# EAGLE design Bartosz.Nowakowski (EAGLE 9.6.0)
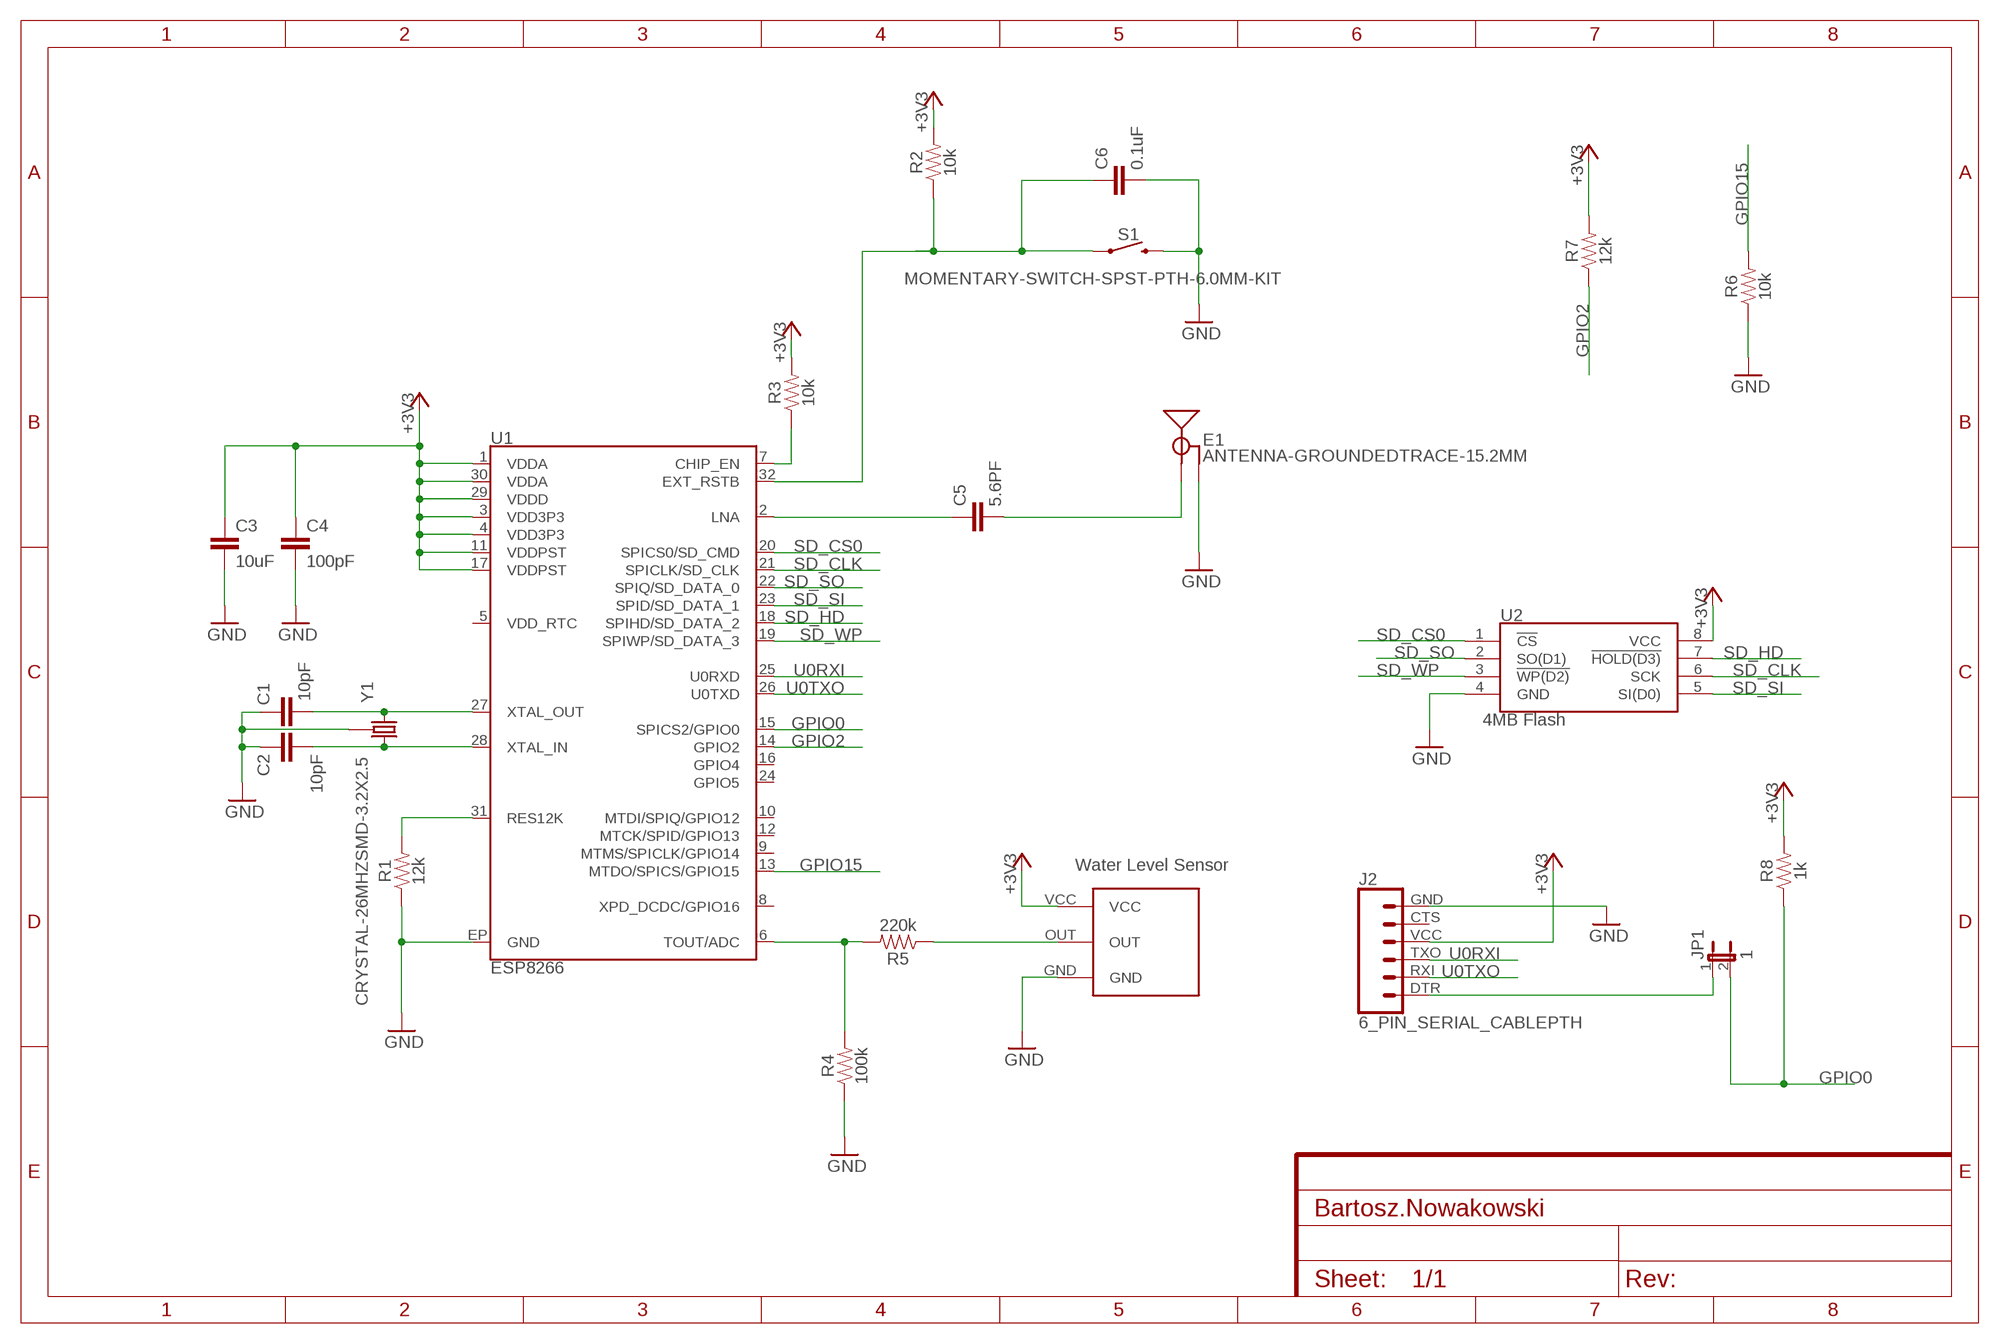
[diagram p0: schematic, sheet 1]

## Parts
C1  10pF  10PF-0603-50V-5%  [0603]
C2  10pF  10PF-0603-50V-5%  [0603]
C3  10uF  10UF-0805-10V-10%  [0805]
C4  100pF  100PF-0603-50V-5%  [0603]
C5  5.6PF  5.6PF-0603-50V-5%  [0603]
C6  0.1uF  0.1UF-0603-25V-5%  [0603]
E1  ANTENNA-GROUNDEDTRACE-15.2MM  [TRACE_ANTENNA_2.4GHZ_15.2MM]
J2  6_PIN_SERIAL_CABLEPTH  [FTDI_BASIC]
JP1  1  JP1E  [JP1]
R1  12k  12KOHM-0603-1/10W-1%  [0603]
R2  10k  10KOHM-0603-1/10W-1%  [0603]
R3  10k  10KOHM-0603-1/10W-1%  [0603]
R4  100k  100KOHM-0603-1/10W-1%  [0603]
R5  220k  220KOHM-0603-1/10W-1%  [0603]
R6  10k  10KOHM-0603-1/10W-1%  [0603]
R7  12k  12KOHM-0603-1/10W-1%  [0603]
R8  1k  1KOHM-0603-1/10W-1%  [0603]
S1  MOMENTARY-SWITCH-SPST-PTH-6.0MM-KIT  [TACTILE_SWITCH_PTH_6.0MM_KIT]
U1  ESP8266  [QFN32-5X5MM]
U2  4MB Flash  AT25SF041  [SO08]
WATER1  WATERLEVELSENORDEV  [WATERLEVELSENSORFT]
Y1  CRYSTAL-26MHZSMD-3.2X2.5  [CRYSTAL-SMD-3.2X2.5MM]

## Nets
+3V3: C3.1 C4.1 J2.VCC R2.2 R3.2 R7.2 R8.2 U1.1(VDDA) U1.3(VDD3P3) U1.4(VDD3P3) U1.11(VDDPST) U1.17(VDDPST) U1.29(VDDD) U1.30(VDDA) U2.8(VCC) WATER1.VCC
GND: C1.1 C2.1 C3.2 C4.2 C6.2 E1.GND J2.GND R1.1 R4.1 R6.1 S1.3 U1.EP(GND) U2.4(GND) WATER1.GND Y1.2 Y1.4
GPIO0: JP1.2 R8.1 U1.15(SPICS2/GPIO0)
GPIO2: R7.1 U1.14(GPIO2)
GPIO15: R6.2 U1.13(MTDO/SPICS/GPIO15)
N$1: R1.2 U1.31(RES12K)
N$2: C1.2 U1.27(XTAL_OUT) Y1.1
N$3: C2.2 U1.28(XTAL_IN) Y1.3
N$4: R3.1 U1.7(CHIP_EN)
N$5: C6.1 R2.1 S1.1 U1.32(EXT_RSTB)
N$6: C5.1 U1.2(LNA)
N$7: C5.2 E1.ANT(SIGNAL)
N$8: R4.2 R5.2 U1.6(TOUT/ADC)
N$9: R5.1 WATER1.OUT
N$10: J2.DTR JP1.1
SD_CLK: U1.21(SPICLK/SD_CLK) U2.6(SCK)
SD_CS0: U1.20(SPICS0/SD_CMD) U2.1(!CS)
SD_HD: U1.18(SPIHD/SD_DATA_2) U2.7(!HOLD(D3))
SD_SI: U1.23(SPID/SD_DATA_1) U2.5(SI(D0))
SD_SO: U1.22(SPIQ/SD_DATA_0) U2.2(SO(D1))
SD_WP: U1.19(SPIWP/SD_DATA_3) U2.3(!WP(D2))
U0RXI: J2.TXO U1.25(U0RXD)
U0TXO: J2.RXI U1.26(U0TXD)
Unconnected: J2.CTS U1.5(VDD_RTC) U1.8(XPD_DCDC/GPIO16) U1.9(MTMS/SPICLK/GPIO14) U1.10(MTDI/SPIQ/GPIO12) U1.12(MTCK/SPID/GPIO13) U1.16(GPIO4) U1.24(GPIO5)

## Library data of the parts
C1 C2 = SparkFun-Capacitors:10PF: 10pF ceramic capacitors A capacitor is a passive two-terminal electrical component used to store electrical energy temporarily in an electric field.; PROD_ID: CAP-11812
C3 = SparkFun-Capacitors:10UF: 10.0µF ceramic capacitors A capacitor is a passive two-terminal electrical component used to store electrical energy temporarily in an electric field.; PROD_ID: CAP-11330
C4 = SparkFun-Capacitors:100PF: 100pF/0.1nF ceramic capacitors A capacitor is a passive two-terminal electrical component used to store electrical energy temporarily in an electric field.; PROD_ID: CAP-07883
C5 = SparkFun-Capacitors:5.6PF: 5.6pF ceramic capacitors A capacitor is a passive two-terminal electrical component used to store electrical energy temporarily in an electric field.; PROD_ID: CAP-12456
C6 = SparkFun-Capacitors:0.1UF: 0.1µF ceramic capacitors A capacitor is a passive two-terminal electrical component used to store electrical energy temporarily in an electric field.; PROD_ID: CAP-08604
E1 = SparkFun-RF:ANTENNA-GROUNDED: Antenna w/ Ground Connection 2.4GHz antennae with signal and ground terminals. TRACE_ANTENNA_2.4GHZ_15.2MM - Meander Trace antenna 15.2 x 5.7mm footprint Based on layout from TI app note AN043 <http://www.ti.com/lit/an/swra117d/swra117d.pdf>. TRACE_ANTENNA_2.4GHZ_25.7MM - Inverted F trace antenna 25.7 x 7.5 mm footprint. Based on layout from TI design note DN0007 <http://www.ti.com/lit/an/swru120b/swru120b.pdf>.
J2 = SparkFun-Connectors:6_PIN_SERIAL_CABLE: 6-pin header connection for use with the "FTDI BASIC" pinout - CABLE SIDE. Also known as "Arduino Serial Program Header". This is used on a design to provide a 6-pin connection point for serial communication usually from a USB cable (D+/D-) to these headers (RX/TX). It also has the remaining pins necessary for programming in the Arduino evironment (DTR, GND, and sometimes VCC). Note, this device has "CABLE" in the name. It is intended to be used on a design that usually lives on the end of your USB cable and prvides the converter chip (FTDI232 or FTDI231x) to commnicate serial RX/TX. The "sister" device, named "TARGET" is inteneded to be used on a design that contains a target micro-controller that you wish to program. You can populate with some of these: Female Headers <https://www.sparkfun.com/products/115> (PRT-00115) For reference (or to suit your programming needs) check out these designs: SparkFun FTDI Basic Breakout - 5V <https://www.sparkfun.com/products/9716> (DEV-09716) SparkFun FTDI Basic Breakout - 3.3V <https://www.sparkfun.com/products/9873> (DEV-09873) SparkFun FTDI SmartBasic <https://www.sparkfun.com/products/12935> (DEV-12935) SparkFun Beefy 3 - FTDI Basic Breakout <https://www.sparkfun.com/products/13746> (DEV-13746)
JP1 = jumper:JP1E: JUMPER
R1 R7 = SparkFun-Resistors:12KOHM: 12kΩ resistor A resistor is a passive two-terminal electrical component that implements electrical resistance as a circuit element. Resistors act to reduce current flow, and, at the same time, act to lower voltage levels within circuits. - Wikipedia; PROD_ID: RES-10327
R2 R3 R6 = SparkFun-Resistors:10KOHM: 10kΩ resistor A resistor is a passive two-terminal electrical component that implements electrical resistance as a circuit element. Resistors act to reduce current flow, and, at the same time, act to lower voltage levels within circuits. - Wikipedia; PROD_ID: RES-00824
R4 = SparkFun-Resistors:100KOHM: 100kΩ resistor A resistor is a passive two-terminal electrical component that implements electrical resistance as a circuit element. Resistors act to reduce current flow, and, at the same time, act to lower voltage levels within circuits. - Wikipedia; PROD_ID: RES-07828
R5 = SparkFun-Resistors:220KOHM: 220kΩ resistor A resistor is a passive two-terminal electrical component that implements electrical resistance as a circuit element. Resistors act to reduce current flow, and, at the same time, act to lower voltage levels within circuits. - Wikipedia; PROD_ID: RES-08969
R8 = SparkFun-Resistors:1KOHM: 1kΩ resistor A resistor is a passive two-terminal electrical component that implements electrical resistance as a circuit element. Resistors act to reduce current flow, and, at the same time, act to lower voltage levels within circuits. - Wikipedia; PROD_ID: RES-07856
S1 = SparkFun-Switches:MOMENTARY-SWITCH-SPST: Momentary Switch (Pushbutton) - SPST Normally-open (NO) SPST momentary switches (buttons, pushbuttons). Variants PTH-12MM - 12mm square, through-hole Momentary Pushbutton Switch - 12mm Square <https://www.sparkfun.com/products/9190> (COM-09190) PTH-6.0MM, PTH-6.0MM-KIT - 6.0mm square, through-hole Mini Pushbutton Switch <https://www.sparkfun.com/products/97> (COM-00097) KIT package intended for soldering kit's - only one side of pads' copper is exposed. PTH-RIGHT-ANGLE-KIT - Right-angle, through-hole Right Angle Tactile Button <https://www.sparkfun.com/products/10791> - Used on SparkFun BigTime Watch Kit <https://www.sparkfun.com/products/11734> SMD-12MM - 12mm square, surface-mount Tactile Button - SMD (12mm) <https://www.sparkfun.com/products/12993> (COM-12993) Used on SparkFun PicoBoard <https://www.sparkfun.com/products/11888> SMD-4.5MM - 4.5mm Square Trackball Switch Used on SparkFun Blackberry Trackballer Breakout <https://www.sparkfun.com/products/13169> SMD-4.6MMX2.8MM - 4.60mm x 2.80mm, surface mount Used on SparkFun SAMD21 Mini Breakout <https://www.sparkfun.com/products/13664> SMD-5.2MM, SMD-5.2-REDUNDANT - 5.2mm square, surface-mount Mini Pushbutton Switch - SMD <https://www.sparkfun.com/products/8720> (COM-08720) Used on Arduino Pro Mini <https://www.sparkfun.com/products/11114> REDUNDANT package connects both switch circuits together SMD-6.0X3.5MM - 6.0 x 3.5mm, surface mount Momentary Reset Switch SMD <https://www.sparkfun.com/products/8229> (COM-08229) SMD-6.2MM-TALL - 6.2mm square, surface mount Tactile Button - SMD (6mm) <https://www.sparkfun.com/products/12992> Used on SparkFun Digital Sandbox <https://www.sparkfun.com/products/12651> SMD-RIGHT-ANGLE - Right-angle, surface mount Used on SparkFun Block for Intel® Edison - Arduino <https://www.sparkfun.com/products/13036>; PROD_ID: SWCH-08441; SF_SKU: COM-00097
U1 = SparkFun-RF:ESP8266: Espressif ESP8266 WiFi/Microcontroller SoC The ESP8266 WiFi Module is a self contained SOC with integrated TCP/IP protocol stack that can give any microcontroller access to your WiFi network. The ESP8266 is capable of either hosting an application or offloading all Wi-Fi networking functions from another application processor. SparkFun Products WiFi Module ESP8266 <https://www.sparkfun.com/products/13678> (WRL-13678) SparkFun ESP8266 Thing <https://www.sparkfun.com/products/13231> (WRL-13231) SparkFun WiFi Shield - ESP8266 <https://www.sparkfun.com/products/13287> (WRL-13287) SparkFun ESP8266 Thing - Dev Board <https://www.sparkfun.com/products/13711> (WRL-13711) SparkFun Blynk Board - ESP8266 <https://www.sparkfun.com/products/13794> (WRL-13794); PROD_ID: IC-12452
U2 = SparkFun-IC-Memory:AT25SF041: AT25SF041 4Mb Serial Flash Memory 104MHz, SPI, 8-SOIC Datasheet <http://www.adestotech.com/wp-content/uploads/DS-AT25SF041_044.pdf> SparkFun Products: SparkFun ESP8266 Thing <https://www.sparkfun.com/products/13231> SparkFun ESP8266 Thing - Dev Board <https://www.sparkfun.com/products/13711>; PROD_ID: IC-12455
WATER1 = WaterLevel:WATERLEVELSENORDEV
Y1 = SparkFun-Clocks:CRYSTAL-26MHZ: 26MHz Crystal w/ Ground Pin Digikey Example <http://www.digikey.com/product-detail/en/epson/TSX-3225%2026.0000MF09Z-AC3/SER3627CT-ND/1802878> Frequency: 26MHz Frequency Stability: ±9ppm Frequency Tolerance: ±10ppm Load Capacitance: 9pF SparkFun Products: SparkFun ESP32 Thing <https://www.sparkfun.com/products/13907> SparkFun ESP8266 Thing Dev Board <https://www.sparkfun.com/products/13711>; PROD_ID: XTAL-12454

## Board
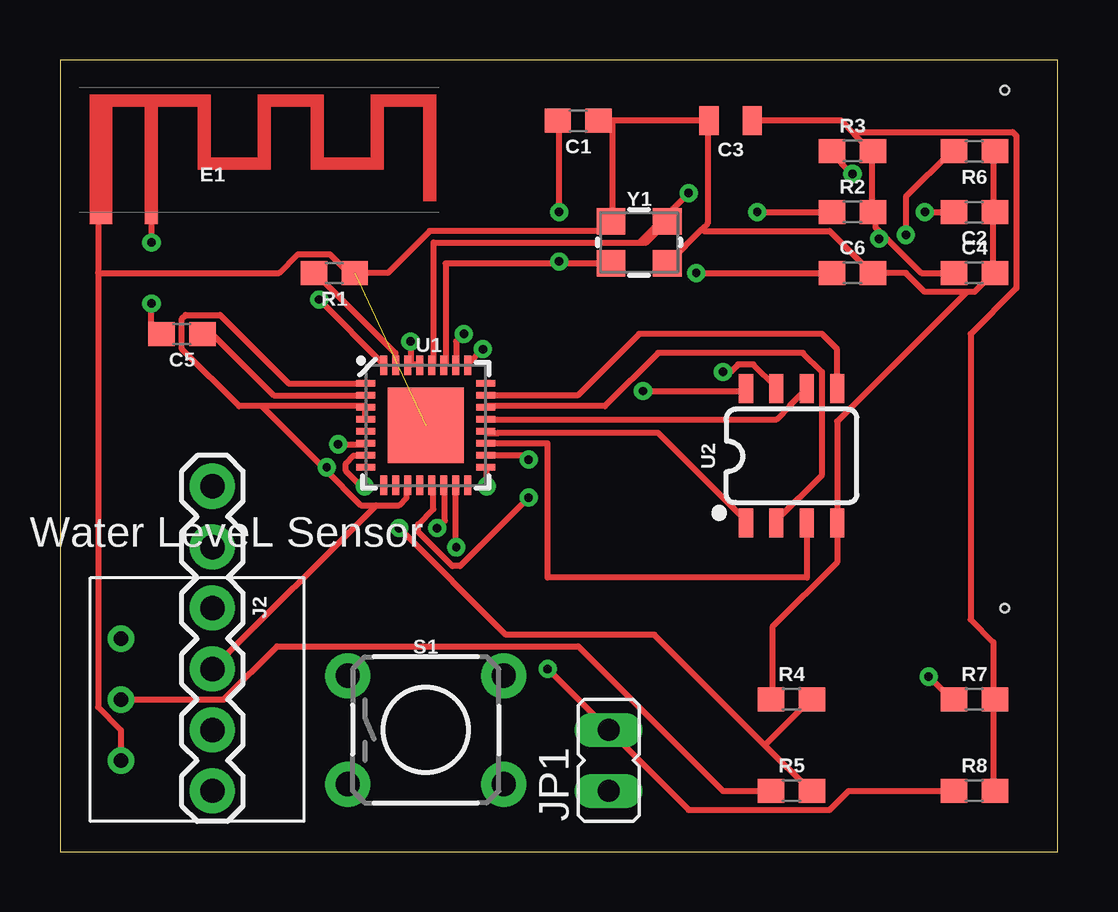
[diagram p1: board, top side]
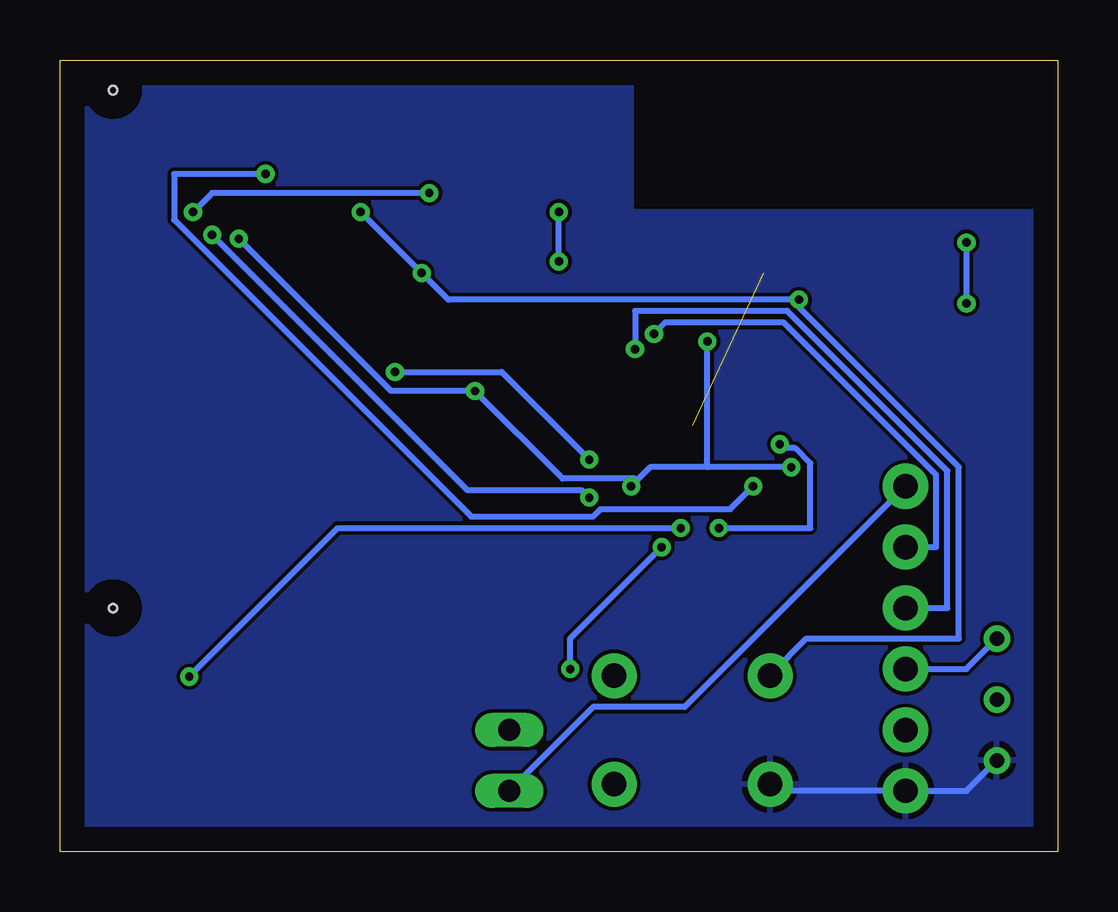
[diagram p2: board, bottom side, seen from below]

Size 41.58 x 33.01 mm. Coordinates in mm from the lower left corner, seen from the top.
Outline: 0,0 41.58,0 41.58,33.01 0,33.01 0,0
Copper layers (1*16): Top 0.035mm / dielectric 1.5mm / Bottom 0.035mm
Design rules "default *": minimum track width 10mil, minimum drill 0.35mm, track to track 6mil, track to pad 6mil, pad to pad 6mil, via to via 6mil, smd to smd 6mil, copper to edge 40mil, drill to drill 6mil, minimum pad ring 10mil, minimum via ring 8mil, stop-mask expansion 4mil, vias tented up to drill 0mil, thermal gap 10mil
Holes 0.35 mm at 39.37,31.75 39.37,10.16

### Footprints (pad centres in the part's own frame; a part is rotated, then mirrored left to right if it is on the bottom)
0603 = smd 1.1 x 1: 1 -0.85,0; 2 0.85,0
0805 = smd 0.8 x 1.2: 1 -0.9,0; 2 0.9,0
TRACE_ANTENNA_2.4GHZ_15.2MM = smd 0.5 x 0.5: ANT 0,-0.25 | smd 0.9 x 0.5: GND -2.1,-0.25
FTDI_BASIC = drill 1.016 pad 1.88: CTS 10.16,0; DTR 0,0; GND 12.7,0; RXI 2.54,0; TXO 5.08,0; VCC 7.62,0
JP1 = drill 0.914 long: 1 0,-1.27; 2 0,1.27
TACTILE_SWITCH_PTH_6.0MM_KIT = drill 1.016 pad 1.88: 1 -3.251,2.261; 2 3.251,2.261; 3 -3.251,-2.261; 4 3.251,-2.261
QFN32-5X5MM = smd 0.8 x 0.285: 1 -2.5,1.75; 2 -2.5,1.25; 3 -2.5,0.75; 4 -2.5,0.25; 5 -2.5,-0.25; 6 -2.5,-0.75; 7 -2.5,-1.25; 8 -2.5,-1.75; 17 2.5,-1.75; 18 2.5,-1.25; 19 2.5,-0.75; 20 2.5,-0.25; 21 2.5,0.25; 22 2.5,0.75; 23 2.5,1.25; 24 2.5,1.75 | smd 0.285 x 0.8: 9 -1.75,-2.5; 10 -1.25,-2.5; 11 -0.75,-2.5; 12 -0.25,-2.5; 13 0.25,-2.5; 14 0.75,-2.5; 15 1.25,-2.5; 16 1.75,-2.5; 25 1.75,2.5; 26 1.25,2.5; 27 0.75,2.5; 28 0.25,2.5; 29 -0.25,2.5; 30 -0.75,2.5; 31 -1.25,2.5; 32 -1.75,2.5 | smd 3.15 x 3.15: EP 0,0
SO08 = smd 0.6 x 1.2: 1 -1.905,-2.8; 2 -0.635,-2.8; 3 0.635,-2.8; 4 1.905,-2.8; 5 1.905,2.8; 6 0.635,2.8; 7 -0.635,2.8; 8 -1.905,2.8
WATERLEVELSENSORFT = drill 0.6: GND -7.62,-2.54; OUT -7.62,0; VCC -7.62,2.54
CRYSTAL-SMD-3.2X2.5MM = smd 1.2 x 1.1: 1 -1.175,-0.875; 2 1.175,-0.875; 3 1.175,0.875; 4 -1.175,0.875

### Placement (x,y rotation side)
C1  21.59,30.48 180 top
C2  38.1,26.67 180 top
C3  27.94,30.48 180 top
C4  38.1,24.13 0 top
C5  5.08,21.59 180 top
C6  33.02,24.13 0 top
E1  3.81,26.67 0 top
J2  6.35,15.24 270 top
JP1  22.86,3.81 0 top
R1  11.43,24.13 180 top
R2  33.02,26.67 0 top
R3  33.02,29.21 0 top
R4  30.48,6.35 0 top
R5  30.48,2.54 0 top
R6  38.1,29.21 180 top
R7  38.1,6.35 0 top
R8  38.1,2.54 0 top
S1  15.24,5.08 0 top
U1  15.24,17.78 0 top
U2  30.48,16.51 0 top
WATER1  10.16,6.35 0 top
Y1  24.13,25.4 0 top

### Tracks (layer width: path | path; a pad name or v marks a point on that pad's centre or on a via)
+3V3  (via drill 0.35)
  Top 0.254: 38.89,6.35 38.89,2.54 R8.2 | 33.81,29.21 33.81,26.67 R2.2 33.97,26.67 33.97,26.04 34.37,25.64 | C4.1 35.88,24.13 34.37,25.64 | C3.1 32.54,30.48 33.1,29.92 | 33.81,29.21 33.1,29.92 | 33.81,29.21 R3.2 | 38.89,6.35 38.89,8.73 37.94,9.68 37.94,21.59 39.85,23.5 39.85,29.84 39.69,30 33.18,30 33.1,29.92 | 38.89,6.35 R7.2 | 14.61,20.32 14.92,20.32 U1.29 | U1.4 12.7,18.1 12.7,18.41 U1.3 12.7,18.57 8.41,18.57 | 8.41,18.57 7.46,18.57 5.08,20.95 5.08,22.23 5.24,22.38 6.67,22.38 9.53,19.53 12.7,19.53 U1.1 | 13.18,14.45 12.54,14.45 11.03,15.95 | 13.18,14.45 14.13,14.45 14.45,14.76 14.45,15.24 U1.11 | 8.41,18.57 11.03,15.95 | v17.78,15.24 17.78,16.03 U1.17 | v11.11,16.03 11.03,15.95 | v14.61,21.27 14.61,20.32 | 14.61,20.32 U1.30 | v24.29,19.21 28.57,19.21 U2.8 | 13.18,14.45 J2.VCC | v34.13,25.56 34.29,25.56 34.37,25.64
  Bottom 0.254: WATER1.VCC 3.81,7.62 J2.VCC | v11.11,16.03 14.61,16.03 | 14.61,16.03 16.99,16.03 v17.78,15.24 17.62,15.56 20.64,15.56 v24.29,19.21 27.78,19.21 v34.13,25.56 | 14.61,16.03 v14.61,21.27
GND  (1 unrouted)
  Top 0.254: 12.22,24.13 R1.1 | 1.75,26.51 E1.GND 1.59,26.35 1.59,24.13 | R4.1 29.69,6.35 29.69,9.37 32.38,12.06 U2.4 32.38,17.94 37.78,23.34 | 38.89,26.67 38.89,29.21 R6.1 | 37.78,23.34 38.1,23.34 38.89,24.13 | 37.78,23.34 36.04,23.34 35.24,24.13 C6.2 33.81,24.13 32.07,25.88 26.83,25.88 26.75,25.96 | 38.89,24.13 38.89,26.67 | 38.89,26.67 C2.1 | 38.89,24.13 C4.2 | 26.99,30.48 23.02,30.48 | 23.02,30.48 C1.1 | 23.02,30.48 23.02,26.35 Y1.4 22.86,26.19 22.54,25.88 15.4,25.88 13.65,24.13 R1.1 | 26.75,25.96 26.99,26.19 26.99,30.48 | 26.75,25.96 25.4,24.61 Y1.2 | 26.99,30.48 C3.2 | WATER1.GND 2.54,5.08 1.59,6.03 1.59,24.13 | 1.59,24.13 9.13,24.13 9.91,24.91 11.25,24.91 12.03,24.13 R1.1
  Bottom 0.254: WATER1.GND 3.81,2.54 J2.GND 11.75,2.54 11.91,2.7 S1.3
  pour Bottom: 0,26.67 17.78,26.67 17.78,33.02 40.64,33.02 40.64,0 0,0
GPIO0  (via drill 0.35)
  Top 0.254: v20.32,7.62 JP1.2 26.19,1.75 32.07,1.75 32.86,2.54 R8.1 | v16.51,12.7 16.49,12.72 U1.15
  Bottom 0.254: v20.32,7.62 20.32,8.89 v16.51,12.7
GPIO2  (via drill 0.35)
  Top 0.254: v15.72,13.49 16.03,13.81 16.03,15.24 U1.14 | v36.2,7.3 37.15,6.35 R7.1
  Bottom 0.254: v15.72,13.49 30,13.49 v36.2,7.3
GPIO15  (via drill 0.35)
  Top 0.254: v19.53,14.76 16.67,11.91 16.35,11.91 14.92,13.34 14.92,13.65 15.56,14.29 15.56,15.24 U1.13 | v35.24,25.72 35.24,27.3 37.15,29.21 R6.2
  Bottom 0.254: v19.53,14.76 19.84,15.08 24.61,15.08 v35.24,25.72
N$1
  Top 0.254: U1.31 13.97,20.32 13.97,20.8 10.64,24.13 R1.2
N$2  (via drill 0.35)
  Top 0.254: U1.27 16.07,20.36 16.07,24.52 20.8,24.52 | Y1.1 20.8,24.52 | v20.8,26.67 20.8,30.48 C1.2 | v20.8,24.61 20.8,24.52
  Bottom 0.254: v20.8,24.61 v20.8,26.67
N$3  (via drill 0.35)
  Top 0.254: U1.28 15.57,20.36 15.57,25.4 24.13,25.4 | Y1.3 24.43,25.4 24.13,25.4 | v36.04,26.67 C2.2 | 24.13,25.4 v26.19,27.46
  Bottom 0.254: v36.04,26.67 35.24,27.46 v26.19,27.46
N$4  (via drill 0.35)
  Top 0.254: v12.7,15.24 12.54,15.24 11.91,15.88 11.91,16.19 12.22,16.51 12.7,16.51 U1.7 | v33.02,28.26 32.07,29.21 R3.1
  Bottom 0.254: v12.7,15.24 13.65,14.29 19.05,14.29 19.37,13.97 24.45,13.97 36.83,26.35 36.83,28.26 v33.02,28.26
N$5  (via drill 0.35)
  Top 0.254: v10.79,23.02 13.49,20.32 U1.32 | v26.51,24.13 C6.1 | v29.05,26.67 R2.1
  Bottom 0.254: S1.1 11.91,7.46 10.48,8.89 4.13,8.89 4.13,16.03 10.79,22.7 v10.79,23.02 25.4,23.02 v26.51,24.13 v29.05,26.67
N$6
  Top 0.254: C5.1 6.35,21.59 8.91,19.03 U1.2
N$7  (via drill 0.35)
  Top 0.254: C5.2 3.81,21.59 v3.81,22.86 | E1.ANT v3.81,25.4
  Bottom 0.254: v3.81,25.4 v3.81,22.86
N$8  (via drill 0.35)
  Top 0.254: v11.59,16.99 12.7,16.99 U1.6 | v14.13,13.49 18.57,9.05 24.77,9.05 29.37,4.45 | 29.37,4.45 31.27,2.54 R5.2 | 29.37,4.45 31.27,6.35 R4.2
  Bottom 0.254: v11.59,16.99 11.43,16.83 10.95,16.83 10.32,16.19 10.32,13.49 v14.13,13.49
N$9
  Top 0.254: R5.1 27.62,2.54 21.59,8.57 9.05,8.57 6.83,6.35 WATER1.OUT
N$10
  Bottom 0.254: JP1.1 19.37,6.03 15.56,6.03 J2.DTR
SD_CLK
  Top 0.254: U2.6 30.42,18.62 30.42,18.59 29.86,18.03 U1.21
SD_CS0
  Top 0.254: U1.20 17.82,17.45 18.26,17.45 18.26,17.46 24.92,17.46 28.57,13.81 U2.1
SD_HD  (via drill 0.35)
  Top 0.254: v19.53,16.35 19.37,16.51 17.78,16.51 U1.18 | v27.62,20 27.94,20 28.26,20.32 28.89,20.32 29.84,19.37 U2.7
  Bottom 0.254: v19.53,16.35 23.18,20 v27.62,20
SD_SI
  Top 0.254: U2.5 32.38,20.95 31.75,21.59 24.13,21.59 21.57,19.03 U1.23
SD_SO
  Top 0.254: U1.22 17.78,18.57 22.7,18.57 24.92,20.8 30.96,20.8 31.75,20 31.75,15.72 29.84,13.81 U2.2
SD_WP
  Top 0.254: U2.3 31.11,11.43 20.32,11.43 20.32,17.03 U1.19
U0RXI  (via drill 0.35)
  Top 0.254: v17.62,20.95 16.99,20.32 U1.25
  Bottom 0.254: v17.62,20.95 17.62,22.54 11.27,22.54 4.6,15.88 4.6,10.16 J2.TXO
U0TXO  (via drill 0.35)
  Top 0.254: v16.83,21.59 16.51,21.27 16.51,20.32 U1.26
  Bottom 0.254: v16.83,21.59 16.35,22.07 11.43,22.07 5.08,15.72 5.08,12.7 J2.RXI